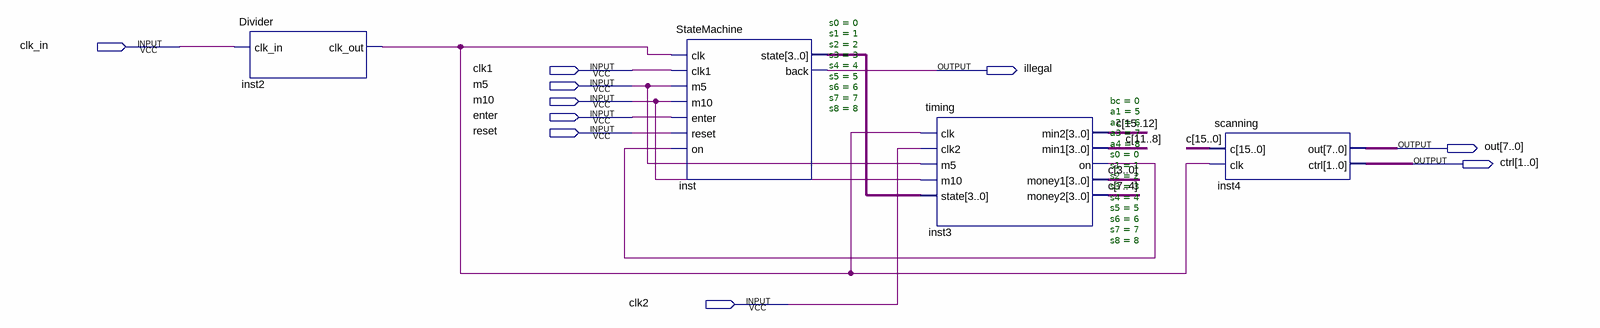
[diagram p0: schematic sheet]
// Quartus schematic charge1.bdf as structural Verilog: 4 symbols, 10 pins
module charge1 (
  input  clk_in,
  input  clk1,
  input  m5,
  input  m10,
  input  enter,
  input  reset,
  input  clk2,
  output illegal,
  output [7:0] out,
  output [1:0] ctrl
);

  wire inst2_clk_out, inst3_on;
  wire [3:0] inst_state;
  wire [15:0] c;

  Divider inst2 (.clk_in(clk_in), .clk_out(inst2_clk_out));
  StateMachine #(.s0(0), .s1(1), .s2(2), .s3(3), .s4(4), .s5(5), .s6(6), .s7(7), .s8(8)) inst (
    .clk(inst2_clk_out), .clk1(clk1), .m5(m5), .m10(m10), .enter(enter), .reset(reset), .on(inst3_on),
    .state(inst_state), .back(illegal));
  timing #(.bc(0), .a1(5), .a2(6), .a3(7), .a4(8), .s0(0), .s1(1), .s2(2), .s3(3), .s4(4), .s5(5), .s6(6), .s7(7), .s8(8)) inst3 (
    .clk(inst2_clk_out), .clk2(clk2), .m5(m5), .m10(m10), .state(inst_state), .min2(c[15:12]),
    .min1(c[11:8]), .on(inst3_on), .money1(c[3:0]), .money2(c[7:4]));
  scanning inst4 (.c(c), .clk(inst2_clk_out), .out(out), .ctrl(ctrl));
endmodule
